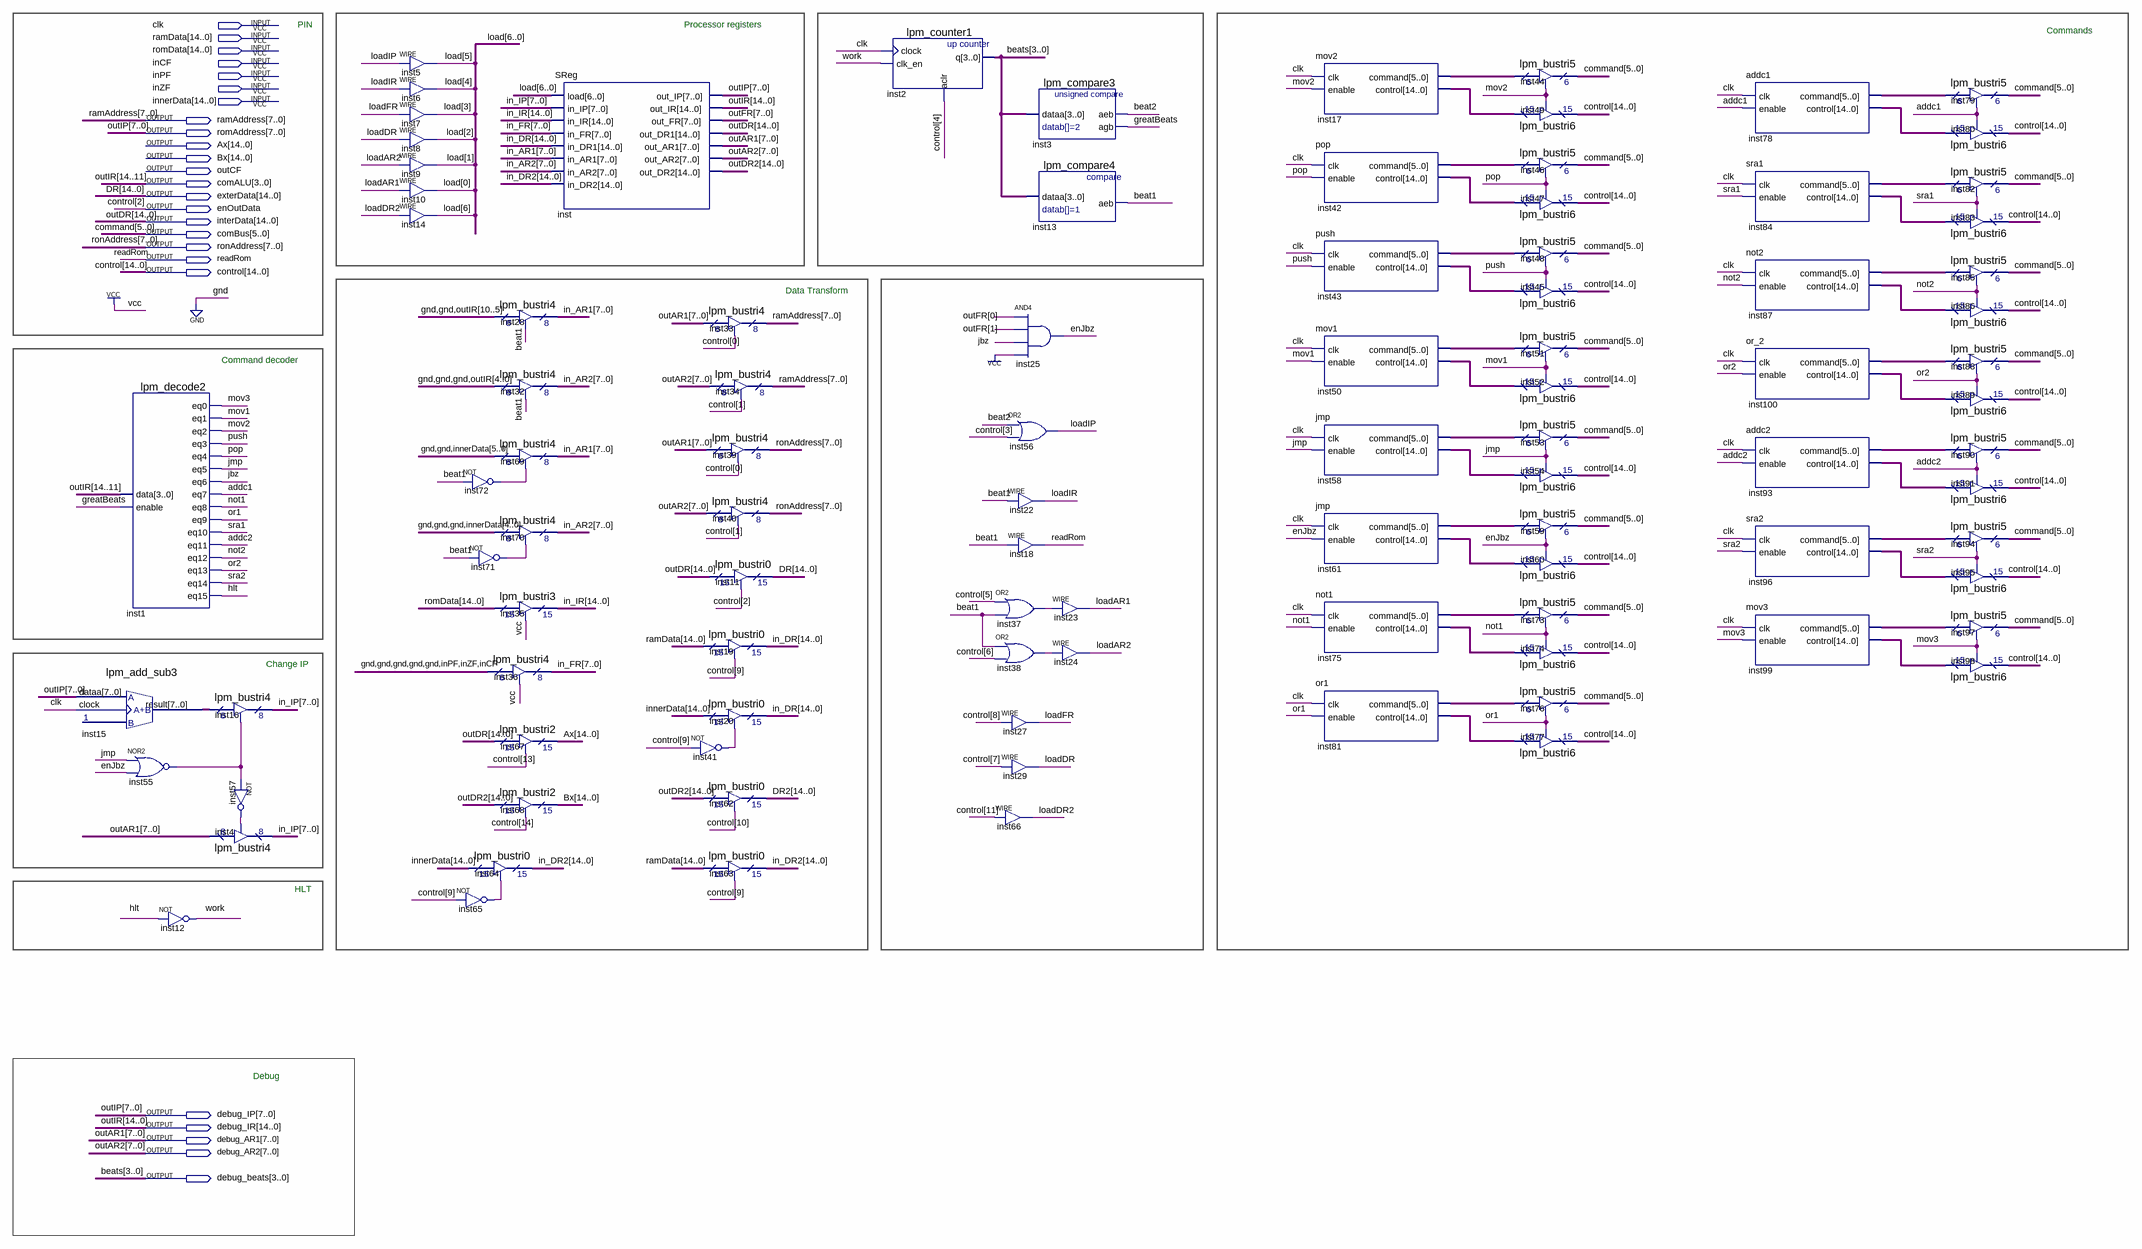
[diagram p0: schematic sheet]
// Quartus schematic CU.bdf as structural Verilog: 96 symbols, 25 pins
module CU (
  input  clk,
  input  [14:0] ramData,
  input  [14:0] romData,
  input  inCF,
  input  inPF,
  input  inZF,
  input  [14:0] innerData,
  output [7:0] ramAddress,
  output [7:0] romAddress,
  output [14:0] Ax,
  output [14:0] Bx,
  output outCF,
  output [3:0] comALU,
  output [14:0] exterData,
  output enOutData,
  output [14:0] interData,
  output [5:0] comBus,
  output [7:0] ronAddress,
  output readRom,
  output [14:0] control,
  output [7:0] debug_IP,
  output [14:0] debug_IR,
  output [7:0] debug_AR1,
  output [7:0] debug_AR2,
  output [3:0] debug_beats
);

  wire addc1, addc2, beat1, beat2, enJbz, greatBeats, hlt, inst37_out, inst38_out, inst41_out, inst55_out,
       inst57_out, inst65_out, inst71_out, inst72_out, jbz, jmp, loadAR1, loadAR2, loadDR, loadDR2, loadFR,
       loadIP, loadIR, mov1, mov2, mov3, not1, not2, or1, or2, pop, push, sra1, sra2, work;
  wire [5:0] inst17_command, inst42_command, inst43_command, inst50_command, inst58_command, inst61_command,
       inst75_command, inst78_command, inst84_command, inst87_command, inst93_command, inst96_command,
       inst99_command, inst100_command;
  wire [6:0] load;
  wire [7:0] in_AR1, in_AR2, in_FR, in_IP, inst15_result, outFR;
  wire [14:0] DR2, in_DR, in_DR2, in_IR, inst17_control, inst42_control, inst43_control, inst50_control,
       inst58_control, inst61_control, inst75_control, inst78_control, inst81_command, inst81_control,
       inst84_control, inst87_control, inst93_control, inst96_control, inst99_control, inst100_control,
       outDR2;

  lpm_decode2 inst1 (
    .data(comALU), .enable(greatBeats), .eq0(mov3), .eq1(mov1), .eq2(mov2), .eq3(push), .eq4(pop), .eq5(jmp),
    .eq6(jbz), .eq7(addc1), .eq8(not1), .eq9(or1), .eq10(sra1), .eq11(addc2), .eq12(not2), .eq13(or2),
    .eq14(sra2), .eq15(hlt));
  lpm_add_sub3 inst15 (.dataa(debug_IP), .clock(clk), .result(inst15_result));
  nor inst55 (inst55_out, jmp, enJbz);
  not inst12 (work, hlt);
  lpm_bustri4 inst16 (.enabledt(inst55_out), .data(inst15_result), .tridata(in_IP));
  lpm_bustri4 inst4 (.enabledt(inst57_out), .data(debug_AR1), .tridata(in_IP));
  not inst57 (inst57_out, inst55_out);
  assign load[5] = loadIP;  // WIRE inst5
  assign load[4] = loadIR;  // WIRE inst6
  assign load[3] = loadFR;  // WIRE inst7
  assign load[2] = loadDR;  // WIRE inst8
  assign load[1] = loadAR2;  // WIRE inst9
  assign load[0] = loadAR1;  // WIRE inst10
  assign load[6] = loadDR2;  // WIRE inst14
  not inst72 (inst72_out, beat1);
  not inst71 (inst71_out, beat1);
  lpm_bustri0 inst64 (.enabledt(inst65_out), .data(innerData), .tridata(in_DR2));
  not inst65 (inst65_out, control[9]);
  lpm_bustri4 inst28 (.enabledt(beat1), .data({2'b00, debug_IR[10:5]}), .tridata(in_AR1));
  lpm_bustri4 inst32 (.enabledt(beat1), .data({3'b000, debug_IR[4:0]}), .tridata(in_AR2));
  lpm_bustri4 inst69 (.enabledt(inst72_out), .data({2'b00, innerData[5:0]}), .tridata(in_AR1));
  lpm_bustri4 inst70 (.enabledt(inst71_out), .data({3'b000, innerData[4:0]}), .tridata(in_AR2));
  lpm_bustri3 inst35 (.enabledt(1'b1), .data(romData), .tridata(in_IR));
  lpm_bustri4 inst36 (.enabledt(1'b1), .data({{5{1'b0}}, inPF, inZF, inCF}), .tridata(in_FR));
  lpm_bustri2 inst67 (.enabledt(control[13]), .data(interData), .tridata(Ax));
  lpm_bustri2 inst68 (.enabledt(control[14]), .data(outDR2), .tridata(Bx));
  SReg inst (
    .load(load), .in_IP(in_IP), .in_IR(in_IR), .in_FR(in_FR), .in_DR1(in_DR), .in_AR1(in_AR1),
    .in_AR2(in_AR2), .in_DR2(in_DR2), .out_IP(debug_IP), .out_IR({comALU, debug_IR[10:0]}), .out_FR(outFR),
    .out_DR1(interData), .out_AR1(debug_AR1), .out_AR2(debug_AR2), .out_DR2(outDR2));
  lpm_bustri4 inst33 (.enabledt(control[0]), .data(debug_AR1), .tridata(ramAddress));
  lpm_bustri4 inst34 (.enabledt(control[1]), .data(debug_AR2), .tridata(ramAddress));
  lpm_bustri4 inst39 (.enabledt(control[0]), .data(debug_AR1), .tridata(ronAddress));
  lpm_bustri4 inst40 (.enabledt(control[1]), .data(debug_AR2), .tridata(ronAddress));
  lpm_bustri0 inst11 (.enabledt(control[2]), .data(interData), .tridata(exterData));
  lpm_bustri0 inst19 (.enabledt(control[9]), .data(ramData), .tridata(in_DR));
  lpm_bustri0 inst20 (.enabledt(inst41_out), .data(innerData), .tridata(in_DR));
  not inst41 (inst41_out, control[9]);
  lpm_bustri0 inst62 (.enabledt(control[10]), .data(outDR2), .tridata(DR2));
  lpm_bustri0 inst63 (.enabledt(control[9]), .data(ramData), .tridata(in_DR2));
  lpm_counter1 inst2 (.clock(clk), .clk_en(work), .aclr(control[4]), .q(debug_beats));
  lpm_compare3 inst3 (.dataa(debug_beats), .aeb(beat2), .agb(greatBeats));
  lpm_compare4 inst13 (.dataa(debug_beats), .aeb(beat1));
  and inst25 (enJbz, outFR[0], outFR[1], jbz, 1'b1);
  or inst56 (loadIP, beat2, control[3]);
  assign loadIR = beat1;  // WIRE inst22
  assign readRom = beat1;  // WIRE inst18
  or inst37 (inst37_out, control[5], beat1);
  or inst38 (inst38_out, beat1, control[6]);
  assign loadFR = control[8];  // WIRE inst27
  assign loadDR = control[7];  // WIRE inst29
  assign loadDR2 = control[11];  // WIRE inst66
  assign loadAR1 = inst37_out;  // WIRE inst23
  assign loadAR2 = inst38_out;  // WIRE inst24
  mov2 inst17 (.clk(clk), .enable(mov2), .command(inst17_command), .control(inst17_control));
  pop inst42 (.clk(clk), .enable(pop), .command(inst42_command), .control(inst42_control));
  push inst43 (.clk(clk), .enable(push), .command(inst43_command), .control(inst43_control));
  mov1 inst50 (.clk(clk), .enable(mov1), .command(inst50_command), .control(inst50_control));
  jmp inst58 (.clk(clk), .enable(jmp), .command(inst58_command), .control(inst58_control));
  jmp inst61 (.clk(clk), .enable(enJbz), .command(inst61_command), .control(inst61_control));
  not1 inst75 (.clk(clk), .enable(not1), .command(inst75_command), .control(inst75_control));
  or1 inst81 (.clk(clk), .enable(or1), .command(inst81_command), .control(inst81_control));
  lpm_bustri5 inst44 (.enabledt(mov2), .data(inst17_command), .tridata(comBus));
  lpm_bustri6 inst49 (.enabledt(mov2), .data(inst17_control), .tridata(control));
  lpm_bustri5 inst46 (.enabledt(pop), .data(inst42_command), .tridata(comBus));
  lpm_bustri6 inst47 (.enabledt(pop), .data(inst42_control), .tridata(control));
  lpm_bustri5 inst48 (.enabledt(push), .data(inst43_command), .tridata(comBus));
  lpm_bustri6 inst45 (.enabledt(push), .data(inst43_control), .tridata(control));
  lpm_bustri5 inst51 (.enabledt(mov1), .data(inst50_command), .tridata(comBus));
  lpm_bustri6 inst52 (.enabledt(mov1), .data(inst50_control), .tridata(control));
  lpm_bustri5 inst53 (.enabledt(jmp), .data(inst58_command), .tridata(comBus));
  lpm_bustri6 inst54 (.enabledt(jmp), .data(inst58_control), .tridata(control));
  lpm_bustri5 inst59 (.enabledt(enJbz), .data(inst61_command), .tridata(comBus));
  lpm_bustri6 inst60 (.enabledt(enJbz), .data(inst61_control), .tridata(control));
  lpm_bustri5 inst73 (.enabledt(not1), .data(inst75_command), .tridata(comBus));
  lpm_bustri6 inst74 (.enabledt(not1), .data(inst75_control), .tridata(control));
  lpm_bustri5 inst76 (.enabledt(or1), .data(inst81_command), .tridata(comBus));
  lpm_bustri6 inst77 (.enabledt(or1), .data(inst81_control), .tridata(control));
  addc1 inst78 (.clk(clk), .enable(addc1), .command(inst78_command), .control(inst78_control));
  sra1 inst84 (.clk(clk), .enable(sra1), .command(inst84_command), .control(inst84_control));
  not2 inst87 (.clk(clk), .enable(not2), .command(inst87_command), .control(inst87_control));
  or_2 inst100 (.clk(clk), .enable(or2), .command(inst100_command), .control(inst100_control));
  addc2 inst93 (.clk(clk), .enable(addc2), .command(inst93_command), .control(inst93_control));
  sra2 inst96 (.clk(clk), .enable(sra2), .command(inst96_command), .control(inst96_control));
  mov3 inst99 (.clk(clk), .enable(mov3), .command(inst99_command), .control(inst99_control));
  lpm_bustri5 inst79 (.enabledt(addc1), .data(inst78_command), .tridata(comBus));
  lpm_bustri6 inst80 (.enabledt(addc1), .data(inst78_control), .tridata(control));
  lpm_bustri5 inst82 (.enabledt(sra1), .data(inst84_command), .tridata(comBus));
  lpm_bustri6 inst83 (.enabledt(sra1), .data(inst84_control), .tridata(control));
  lpm_bustri5 inst85 (.enabledt(not2), .data(inst87_command), .tridata(comBus));
  lpm_bustri6 inst86 (.enabledt(not2), .data(inst87_control), .tridata(control));
  lpm_bustri5 inst88 (.enabledt(or2), .data(inst100_command), .tridata(comBus));
  lpm_bustri6 inst89 (.enabledt(or2), .data(inst100_control), .tridata(control));
  lpm_bustri5 inst90 (.enabledt(addc2), .data(inst93_command), .tridata(comBus));
  lpm_bustri6 inst91 (.enabledt(addc2), .data(inst93_control), .tridata(control));
  lpm_bustri5 inst94 (.enabledt(sra2), .data(inst96_command), .tridata(comBus));
  lpm_bustri6 inst95 (.enabledt(sra2), .data(inst96_control), .tridata(control));
  lpm_bustri5 inst97 (.enabledt(mov3), .data(inst99_command), .tridata(comBus));
  lpm_bustri6 inst98 (.enabledt(mov3), .data(inst99_control), .tridata(control));

  assign debug_IR[14:11] = comALU;
  assign enOutData = control[2];
  assign romAddress = debug_IP;

  // Other names for the same wires on the sheet: beats[3:0] = debug_beats; command[5:0] = comBus;
  //   DR[14:0] = exterData; outAR1[7:0] = debug_AR1; outAR2[7:0] = debug_AR2; outDR[14:0] = interData;
  //   outIP[7:0] = debug_IP; outIR[14:0] = {comALU, debug_IR[10:0]}

  // Notes on the sheet:
  //   PIN
  //   Processor registers
  //   Commands
  //   Data Transform
  //   Command decoder
  //   Change IP
  //   HLT
  //   Debug
endmodule
